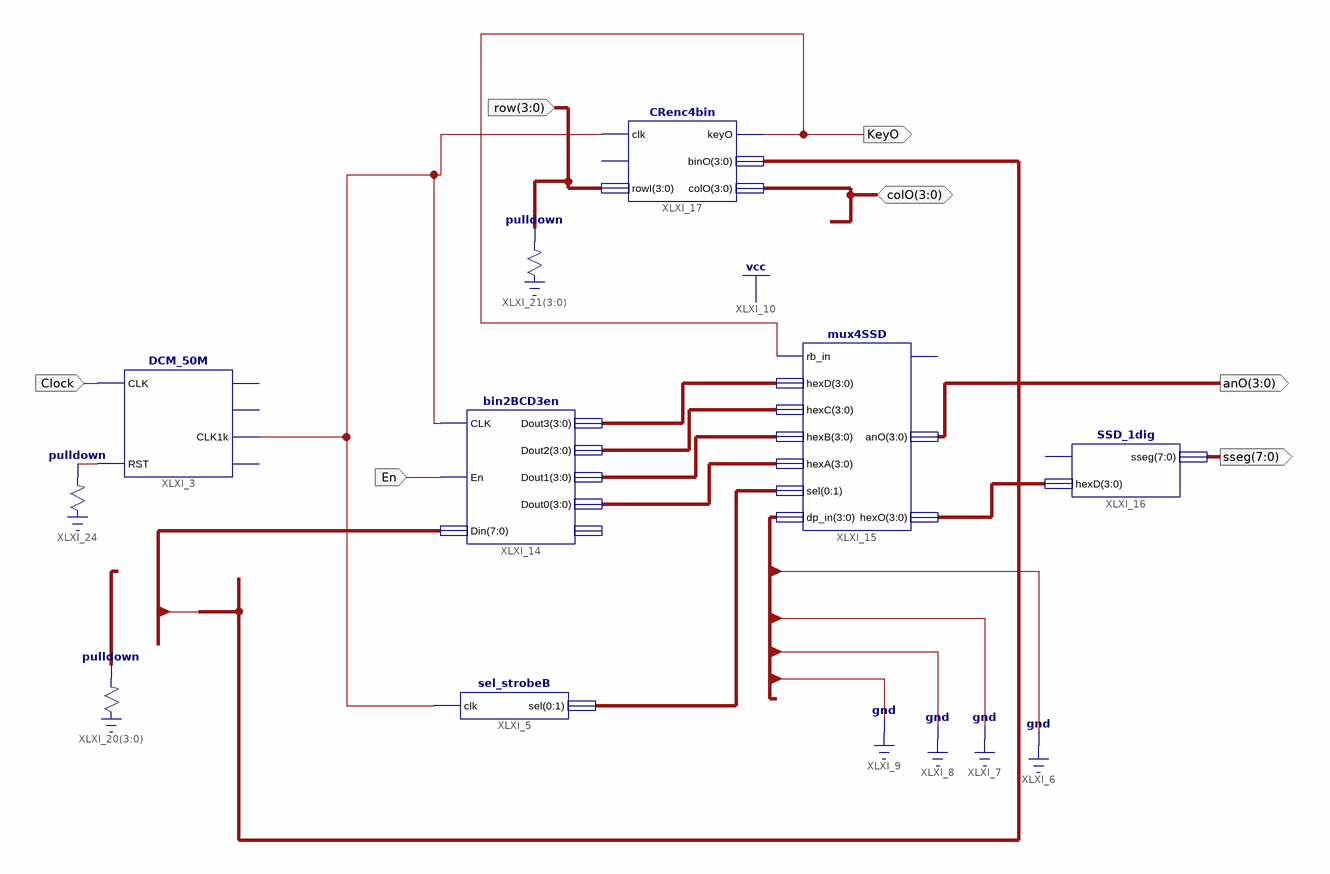
[diagram p0: schematic sheet 1]
// Xilinx ISE schematic lab4_experiment4.sch (spartan3e) as structural Verilog: 9 symbols, 7 ports
module lab4_experiment4 (
  input  En,
  input  [3:0] row,
  input  Clock,
  inout  [3:0] colO,
  output [7:0] sseg,
  output [3:0] anO,
  output KeyO
);

  wire XLXN_30, XLXN_43;
  wire [1:0] XLXN_15;
  wire [3:0] XLXN_3, XLXN_5, XLXN_6, XLXN_7, XLXN_8;
  wire [7:0] Din;

  DCM_50M XLXI_3 (.CLK(Clock), .RST(XLXN_43), .CLK1k(XLXN_30));  // open: CLK1M, CLK10k, CLK1
  sel_strobeB XLXI_5 (.clk(XLXN_30), .sel({XLXN_15[0], XLXN_15[1]}));
  bin2BCD3en XLXI_14 (
    .CLK(XLXN_30), .En(En), .Din(Din), .Dout3(XLXN_6), .Dout2(XLXN_5), .Dout1(XLXN_7), .Dout0(XLXN_3));  // open: RBout
  mux4SSD XLXI_15 (
    .rb_in(KeyO), .hexD(XLXN_6), .hexC(XLXN_5), .hexB(XLXN_7), .hexA(XLXN_3), .sel({XLXN_15[0], XLXN_15[1]}),
    .dp_in(4'b0000), .anO(anO), .hexO(XLXN_8));  // open: dpO
  SSD_1dig XLXI_16 (.hexD(XLXN_8), .sseg(sseg));  // open: dp_in
  CRenc4bin XLXI_17 (.clk(XLXN_30), .rowI(row), .keyO(KeyO), .binO(Din[3:0]), .colO(colO));  // open: CE
  \pulldown  XLXI_20[3:0] (.O(Din[7:4]));
  \pulldown  XLXI_21[3:0] (.O(row));
  \pulldown  XLXI_24 (.O(XLXN_43));
endmodule
